# EAGLE schematic Ebot8_v_1.2 (EAGLE 7.7.0)
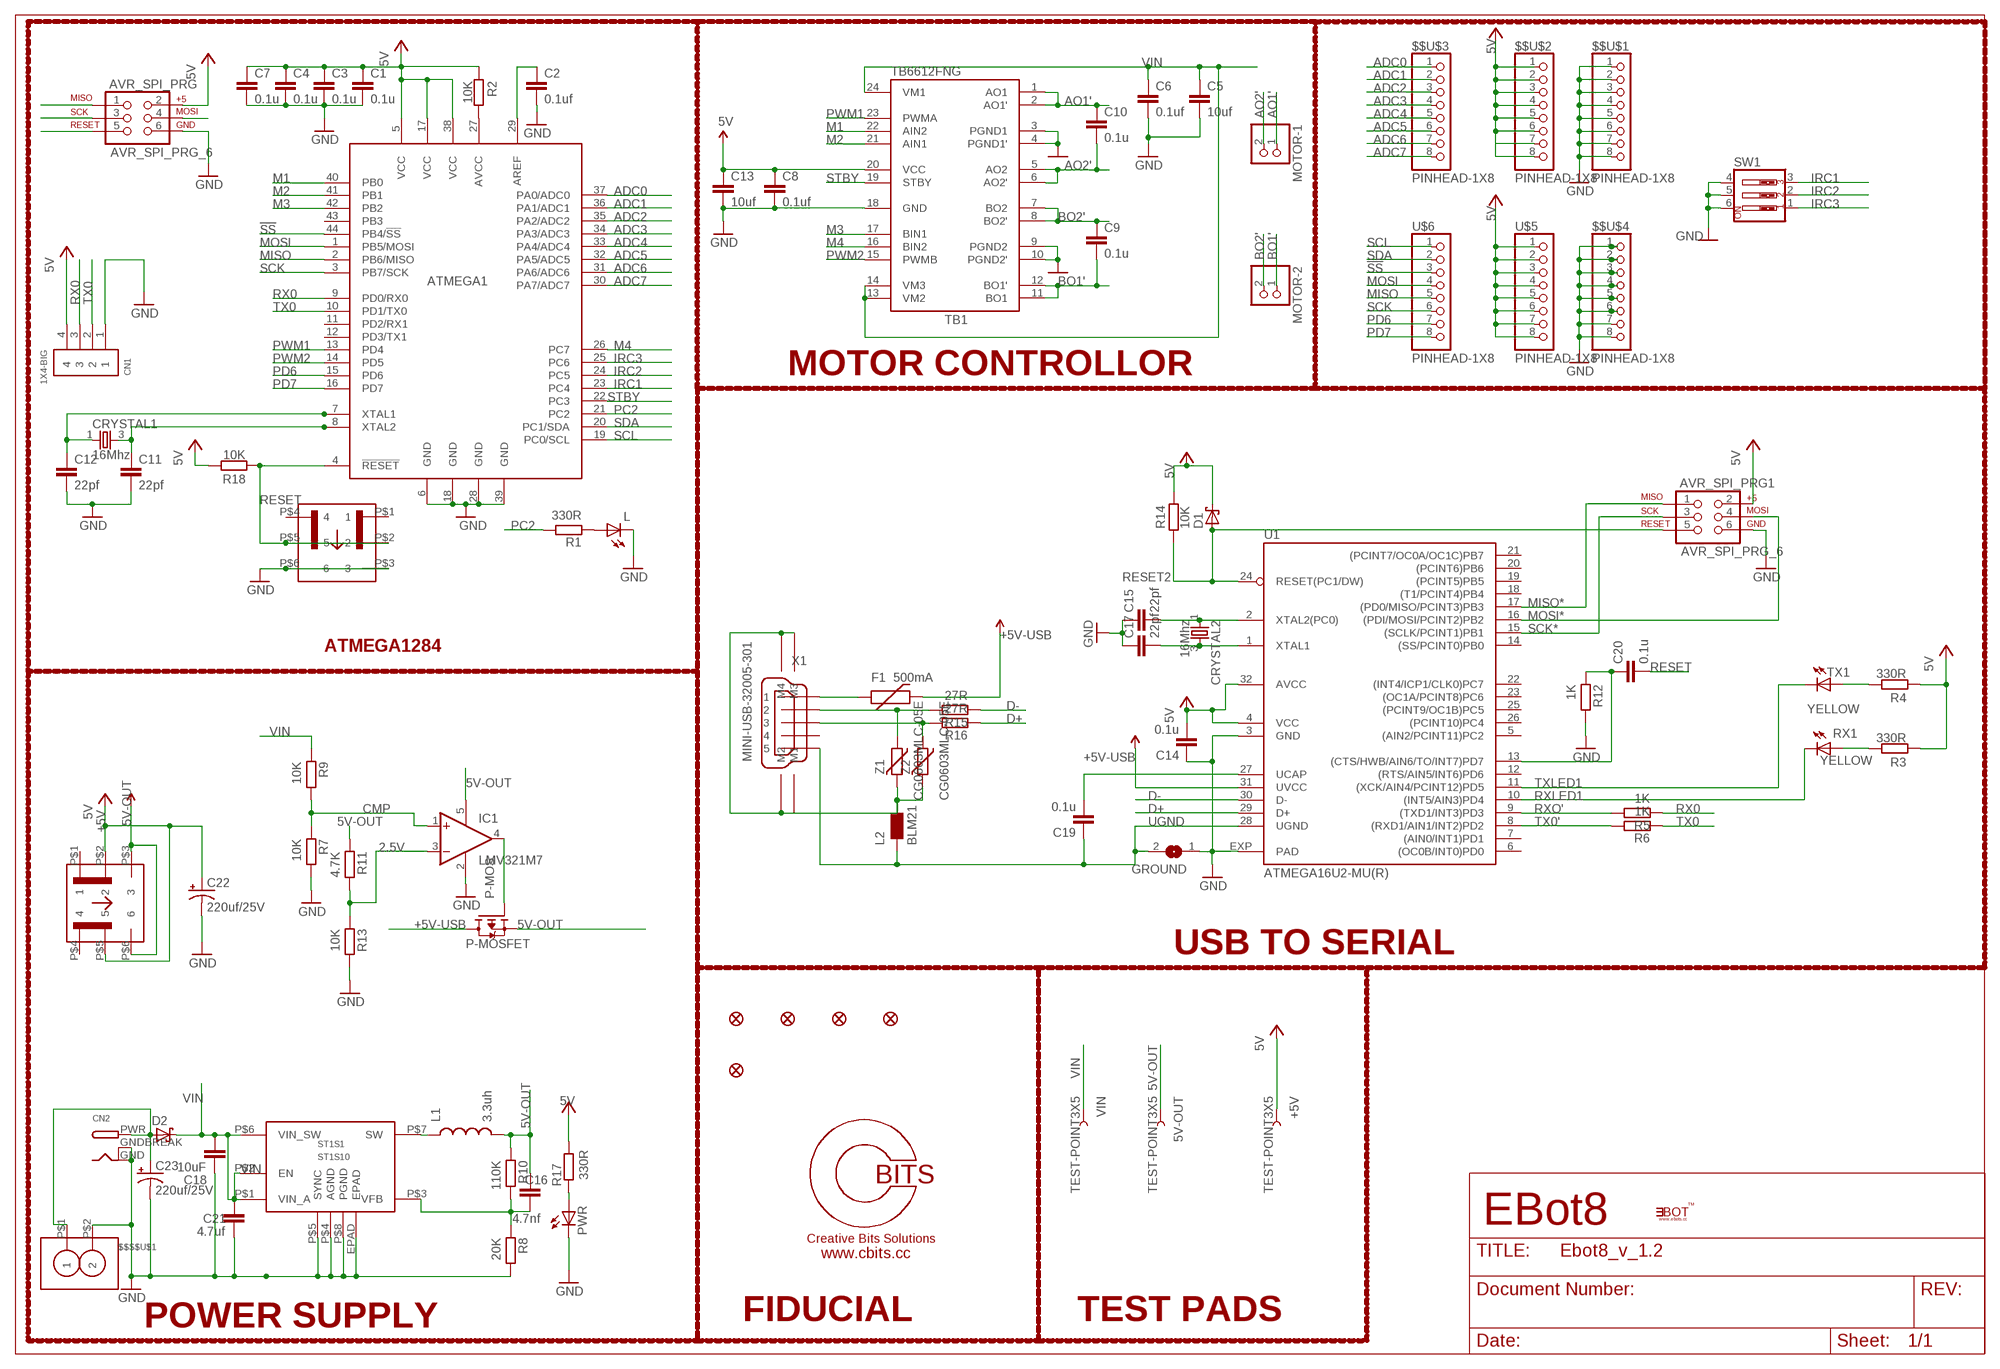
[diagram p0: schematic, sheet 1]

## Parts
5V-OUT  TEST-POINT3X5  [PAD.03X.05]
$$$$U$1  SCREW_CONNECTOR-2PIN-  [SCREW_CONNECTOR-2PIN-5.08MM]
$$U$1  PINHEAD-1X8  [PINHEAD-1X8]
$$U$2  PINHEAD-1X8  [PINHEAD-1X8]
$$U$3  PINHEAD-1X8  [PINHEAD-1X8]
$$U$4  PINHEAD-1X8  [PINHEAD-1X8]
+5V  TEST-POINT3X5  [PAD.03X.05]
ATMEGA1  ATMEGA164A/PA/324A/PA/644A/PA/1284/P  [44TQFP]
AVR_SPI_PRG  AVR_SPI_PRG_6  [2X3]
AVR_SPI_PRG1  AVR_SPI_PRG_6  [2X3]
C1  0.1u  CAPACITOR  [C0603]
C2  0.1uf  CAPACITOR  [C0603]
C3  0.1u  CAPACITOR  [C0603]
C4  0.1u  CAPACITOR  [C0603]
C5  10uf  CAPACITOR  [C0603]
C6  0.1uf  CAPACITOR  [C0603]
C7  0.1u  CAPACITOR  [C0603]
C8  0.1uf  CAPACITOR  [C0603]
C9  0.1u  CAPACITOR  [C0603]
C10  0.1u  CAPACITOR  [C0603]
C11  22pf  CAPACITOR  [C0603]
C12  22pf  CAPACITOR  [C0603]
C13  10uf  CAPACITOR  [C0603]
C14  0.1u  CAPACITOR  [C0603]
C15  22pf  CAPACITOR  [C0603]
C16  4.7nf  CAPACITOR  [C0603]
C17  22pf  CAPACITOR  [C0603]
C18  10uF  CAPACITOR  [C0603]
C19  0.1u  CAPACITOR  [C0603]
C20  0.1u  CAPACITOR  [C0603]
C21  4.7uf  CAPACITOR  [C0603]
C22  220uf/25V  CPOL-USE2.5-6  [E2,5-6]
C23  220uf/25V  CPOL-USE2.5-6  [E2,5-6]
CN1  1X4-BIG  [1X04-BIG]
CN2  DCBARRELPTH  [DCJACK_2MM_PTH]
CRYSTAL1  16Mhz  CRYSTAL4PIN  [CRYSTAL-4PIN]
CRYSTAL2  16Mhz  CRYSTAL4PIN  [CRYSTAL-4PIN]
D1  SCHOTTKY-DIODESMA2  [SCHOTTKY_SMA]
D2  SCHOTTKY-DIODESMA2  [SCHOTTKY_SMA]
F1  500mA  PTCSMD  [PTC-1206]
FID1  FIDUCIAL1.5X3  [FIDUCIAL-1.5X3]
FID2  FIDUCIAL1.5X3  [FIDUCIAL-1.5X3]
FID3  FIDUCIAL1.5X3  [FIDUCIAL-1.5X3]
FID4  FIDUCIAL1.5X3  [FIDUCIAL-1.5X3]
FID100  FIDUCIAL1.5X3  [FIDUCIAL-1.5X3]
GROUND  SJ  [SJ]
IC1  LMV321M7  [SC70-5L]
L  LEDCHIP-LED0603  [CHIP-LED0603]
L1  3.3uh  INDUCTORCR54  [CR54]
L2  BLM21  WE-CBF_0805  [0805]
LOGO1  CBITS_LOGO  [CBITS_LOGO]
MOTOR-1  PINHD-1X2  [1X02]
MOTOR-2  PINHD-1X2  [1X02]
P-MOS  P-MOSFET  [SOT23-R]
POWER  PUSHBUTTON_SWITCH-CW179-ND  PUSHBUTTON_SWITCH-ON-OFF  [PUSHBUTTON_SWITCH]
PWR  LEDCHIP-LED0603  [CHIP-LED0603]
R1  330R  RESISTOR  [R0603]
R2  10K  RESISTOR  [R0603]
R3  330R  RESISTOR  [R0603]
R4  330R  RESISTOR  [R0603]
R5  1K  RESISTOR  [R0603]
R6  1K  RESISTOR  [R0603]
R7  10K  RESISTOR  [R0603]
R8  20K  RESISTOR  [R0603]
R9  10K  RESISTOR  [R0603]
R10  110K  RESISTOR  [R0603]
R11  4.7K  RESISTOR  [R0603]
R12  1K  RESISTOR  [R0603]
R13  10K  RESISTOR  [R0603]
R14  10K  RESISTOR  [R0603]
R15  27R  RESISTOR  [R0603]
R16  27R  RESISTOR  [R0603]
R17  330R  RESISTOR  [R0603]
R18  10K  RESISTOR  [R0603]
RESET  PUSHBUTTON_SWITCH-ON-MOM  [PUSHBUTTON_SWITCH]
RX1  YELLOW  LEDCHIP-LED0603  [CHIP-LED0603]
ST1S1  ST1S10  [ST1S10]
SW1  SW_DIP-3  [EDG-03]
TB1  TB6612FNG  [SSOP24]
TX1  YELLOW  LEDCHIP-LED0603  [CHIP-LED0603]
U1  ATMEGA16U2-MU(R)  SMARTPRJ_ATMEGA16U2-  [SMARTPRJ_ATMEL_QFN32]
U$5  PINHEAD-1X8  [PINHEAD-1X8]
U$6  PINHEAD-1X8  [PINHEAD-1X8]
U$14  EBOT_LOGO  [EBOT_LOGO]
VIN  TEST-POINT3X5  [PAD.03X.05]
X1  MINI-USB-32005-301  [32005-301]
Z1  CG0603MLC-05E  VARISTORCN0603  [CT/CN0603]
Z2  CG0603MLC-05E  VARISTORCN0603  [CT/CN0603]

## Nets
2.5V: IC1.3(-IN) R11.2 R13.1
5V-OUT: 5V-OUT.P$1 C16.1 IC1.5(V+) L1.P$2 P-MOS.2(S) POWER.P$3 POWER.P$6 R10.1 R11.1 ; supply symbol labelled 5V
!SS: ATMEGA1.44(PB4/!SS) U$6.3
+5V: $$U$2.1 $$U$2.2 $$U$2.3 $$U$2.4 $$U$2.5 $$U$2.6 $$U$2.7 $$U$2.8 +5V.P$1 ATMEGA1.5(VCC) ATMEGA1.17(VCC) ATMEGA1.38(VCC) AVR_SPI_PRG1.2 AVR_SPI_PRG.2 C1.1 C3.1 C4.1 C7.1 C8.1 C13.1 C14.2 C22.+ CN1.4 D1.C POWER.P$2 POWER.P$5 R2.1 R3.1 R4.1 R14.2 R17.2 R18.2 TB1.20(VCC) U1.4(VCC) U1.32(AVCC) U$5.1 U$5.2 U$5.3 U$5.4 U$5.5 U$5.6 U$5.7 U$5.8 ; supply symbol labelled 5V
+5V-USB: F1.2 P-MOS.3(D) U1.31(UVCC) ; supply symbol labelled 5V
ADC0: $$U$3.1 ATMEGA1.37(PA0/ADC0)
ADC1: $$U$3.2 ATMEGA1.36(PA1/ADC1)
ADC2: $$U$3.3 ATMEGA1.35(PA2/ADC2)
ADC3: $$U$3.4 ATMEGA1.34(PA3/ADC3)
ADC4: $$U$3.5 ATMEGA1.33(PA4/ADC4)
ADC5: $$U$3.6 ATMEGA1.32(PA5/ADC5)
ADC6: $$U$3.7 ATMEGA1.31(PA6/ADC6)
ADC7: $$U$3.8 ATMEGA1.30(PA7/ADC7)
AO1': C10.1 MOTOR-1.1 TB1.1(AO1) TB1.2(AO1')
AO2': C10.2 MOTOR-1.2 TB1.5(AO2) TB1.6(AO2')
AREF: ATMEGA1.29(AREF) C2.1
BO1': C9.2 MOTOR-2.1 TB1.11(BO1) TB1.12(BO1')
BO2': C9.1 MOTOR-2.2 TB1.7(BO2) TB1.8(BO2')
CMP: IC1.1(+IN) R7.1 R9.2
D+: R16.1 U1.29(D+)
D-: R15.1 U1.30(D-)
GATE_CMD: IC1.4(OUT) P-MOS.1(G)
GND: $$$$U$1.P$2 $$U$1.1 $$U$1.2 $$U$1.3 $$U$1.4 $$U$1.5 $$U$1.6 $$U$1.7 $$U$1.8 $$U$4.1 $$U$4.2 $$U$4.3 $$U$4.4 $$U$4.5 $$U$4.6 $$U$4.7 $$U$4.8 ATMEGA1.6(GND) ATMEGA1.18(GND) ATMEGA1.28(GND) ATMEGA1.39(GND) AVR_SPI_PRG1.6 AVR_SPI_PRG.6 C1.2 C2.2 C3.2 C4.2 C5.2 C6.2 C7.2 C8.2 C11.2 C12.2 C13.2 C14.1 C15.1 C17.1 C18.2 C21.2 C22.- C23.- CN1.1 CN2.GND CN2.GNDBREAK GROUND.1 IC1.2(V-) L.C PWR.C R7.2 R8.2 R12.2 R13.2 RESET.P$3 RESET.P$6 ST1S1.EPAD ST1S1.P$4(AGND) ST1S1.P$5(SYNC) ST1S1.P$8(PGND) SW1.4 SW1.5 SW1.6 TB1.3(PGND1) TB1.4(PGND1') TB1.9(PGND2) TB1.10(PGND2') TB1.18(GND) U1.3(GND) U1.EXP(PAD)
IRC1: ATMEGA1.23(PC4) SW1.3
IRC2: ATMEGA1.24(PC5) SW1.2
IRC3: ATMEGA1.25(PC6) SW1.1
M1: ATMEGA1.40(PB0) TB1.22(AIN2)
M2: ATMEGA1.41(PB1) TB1.21(AIN1)
M3: ATMEGA1.42(PB2) TB1.17(BIN1)
M4: ATMEGA1.26(PC7) TB1.16(BIN2)
MISO: ATMEGA1.2(PB6/MISO) AVR_SPI_PRG.1 U$6.5
MISO*: AVR_SPI_PRG1.1 U1.17((PD0/MISO/PCINT3)PB3)
MOSI: ATMEGA1.1(PB5/MOSI) AVR_SPI_PRG.4 U$6.4
MOSI*: AVR_SPI_PRG1.4 U1.16((PDI/MOSI/PCINT2)PB2)
N$1: PWR.A R17.1
N$2: $$$$U$1.P$1 C23.+ CN2.PWR D2.A
N$3: R3.2 RX1.A
N$4: R4.2 TX1.A
N$5: C15.2 CRYSTAL2.1 U1.2(XTAL2(PC0))
N$6: ATMEGA1.27(AVCC) R2.2
N$7: C17.2 CRYSTAL2.3 U1.1(XTAL1)
N$8: C19.2 U1.27(UCAP)
N$9: C20.1 R12.1 U1.13((CTS/HWB/AIN6/TO/INT7)PD7)
N$10: L2.2 X1.M1 X1.M2 X1.M3 X1.M4 Z1.2 Z2.2
N$17: L.A R1.1
N$20: F1.1 X1.1
N$21: R15.2 X1.2 Z1.1
N$23: R16.2 X1.3 Z2.1
N$37: L1.P$1 ST1S1.P$7(SW)
N$38: C16.2 R8.1 R10.2 ST1S1.P$3(VFB)
N$40: ATMEGA1.8(XTAL2) C11.1 CRYSTAL1.3
N$41: ATMEGA1.7(XTAL1) C12.1 CRYSTAL1.1
PC2: ATMEGA1.21(PC2) R1.2
PD6: ATMEGA1.15(PD6) U$6.7
PD7: ATMEGA1.16(PD7) U$6.8
PWM1: ATMEGA1.13(PD4) TB1.23(PWMA)
PWM2: ATMEGA1.14(PD5) TB1.15(PWMB)
RESET: ATMEGA1.4(!RESET) AVR_SPI_PRG.5 C20.2 R18.1 RESET.P$2 RESET.P$5
RESET2: AVR_SPI_PRG1.5 D1.A R14.1 U1.24(RESET(PC1/DW))
RX0: ATMEGA1.9(PD0/RX0) CN1.3 R5.1
RXLED1: RX1.C U1.10((INT5/AIN3)PD4)
RXO': R5.2 U1.9((TXD1/INT3)PD3)
SCK: ATMEGA1.3(PB7/SCK) AVR_SPI_PRG.3 U$6.6
SCK*: AVR_SPI_PRG1.3 U1.15((SCLK/PCINT1)PB1)
SCL: ATMEGA1.19(PC0/SCL) U$6.1
SDA: ATMEGA1.20(PC1/SDA) U$6.2
STBY: ATMEGA1.22(PC3) TB1.19(STBY)
TX0: ATMEGA1.10(PD1/TX0) CN1.2 R6.1
TX0': R6.2 U1.8((RXD1/AIN1/INT2)PD2)
TXLED1: TX1.C U1.11((XCK/AIN4/PCINT12)PD5)
UGND: C19.1 GROUND.2 L2.1 U1.28(UGND) X1.5
VIN: C5.1 C6.1 C18.1 C21.1 D2.C R9.1 ST1S1.P$1(VIN_A) ST1S1.P$2(EN) ST1S1.P$6(VIN_SW) TB1.13(VM2) TB1.14(VM3) TB1.24(VM1) VIN.P$1
Unconnected: ATMEGA1.11(PD2/RX1) ATMEGA1.12(PD3/TX1) ATMEGA1.43(PB3) POWER.P$1 POWER.P$4 RESET.P$1 RESET.P$4 U1.5((AIN2/PCINT11)PC2) U1.6((OC0B/INT0)PD0) U1.7((AIN0/INT1)PD1) U1.12((RTS/AIN5/INT6)PD6) U1.14((SS/PCINT0)PB0) U1.18((T1/PCINT4)PB4) U1.19((PCINT5)PB5) U1.20((PCINT6)PB6) U1.21((PCINT7/OC0A/OC1C)PB7) U1.22((INT4/ICP1/CLK0)PC7) U1.23((OC1A/PCINT8)PC6) U1.25((PCINT9/OC1B)PC5) U1.26((PCINT10)PC4) X1.4

## Notes on the sheet
- MOTOR CONTROLLOR
- ATMEGA1284
- USB TO SERIAL
- EBot8
- POWER SUPPLY | FIDUCIAL | TEST PADS

## Power pins joined to a net without a drawn wire
GND: ST1S1.P$9(GND) ST1S1.P$10(GND) ST1S1.P$11(GND) ST1S1.P$12(GND) ST1S1.P$13(GND) ST1S1.P$14(GND) ST1S1.P$15(GND) ST1S1.P$16(GND) ST1S1.P$17(GND)

## Library data of the parts
5V-OUT +5V VIN = SparkFun-Passives:TEST-POINT: Bare copper test points for troubleshooting or ICT
$$$$U$1 = BaseApp:SCREW_CONNECTOR-2PIN
$$U$1-$$U$4 U$5 U$6 = BaseApp:PINHEAD-1X8
ATMEGA1 = BaseApp:ATMEGA164A/PA/324A/PA/644A/PA/1284/P
AVR_SPI_PRG AVR_SPI_PRG1 = BaseApp:AVR_SPI_PRG_6
C1-C21 = BaseApp:CAPACITOR
C22 C23 = adafruit:CPOL-US: POLARIZED CAPACITOR, American symbol
CN1 = adafruit:1X4: 4-pin connector
CN2 = adafruit:DCBARREL: 2.0mm DC Barrel Jack DCJACK_2MM_PTH - Through Hole Jack (4UConnector: 05537)
CRYSTAL1 CRYSTAL2 = BaseApp:CRYSTAL: CRYSTAL SMD-10.5X4.8-2PIN :- http://www.digikey.com/product-detail/en/CX49GFNB12000H0PESZZ/478-4349-1-ND/1532102 SMD-5X3- 4PIN :- 535-11281-1-ND
D1 D2 = BaseApp:SCHOTTKY-DIODE
F1 = SparkFun:PTC: Resettable Fuse PTC Resettable Fuse. Spark Fun Electronics SKU : COM-08357
FID1-FID4 FID100 = SparkFun-Aesthetics:FIDUCIAL: Fiducial Alignment Points Various fiducial points for machine vision alignment.
GROUND = jumper:SJ: SMD solder JUMPER
IC1 = linear:LMV321?*: General Purpose, Low Voltage, Rail-to-Rail Output Operational Amplifiers Source: http://www.national.com/mpf/LM/LMV321.html http://www.national.com/dt/lmv_qual.pdf
L PWR RX1 TX1 = adafruit:LED: LED OSRAM: - CHIPLED LG R971, LG N971, LY N971, LG Q971, LY Q971, LO R971, LY R971 LH N974, LH R974 LS Q976, LO Q976, LY Q976 LO Q996 - Hyper CHIPLED LW Q18S LB Q993, LB Q99A, LB R99A - SideLED LS A670, LO A670, LY A670, LG A670, LP A670 LB A673, LV A673, LT A673, LW A673 LH A674 LY A675 LS A676, LA A676, LO A676, LY A676, LW A676 LS A679, LY A679, LG A679 - Hyper Micro SIDELED® LS Y876, LA Y876, LO Y876, LY Y876 LT Y87S - SmartLED LW L88C, LW L88S LB L89C, LB L89S, LG L890 LS L89K, LO L89K, LY L89K LS L896, LA L896, LO L896, LY L896 - TOPLED LS T670, LO T670, LY T670, LG T670, LP T670 LSG T670, LSP T670, LSY T670, LOP T670, LYG T670 LG T671, LOG T671, LSG T671 LB T673, LV T673, LT T673, LW T673 LH T674 LS T676, LA T676, LO T676, LY T676, LB T676, LH T676, LSB T676, LW T676 LB T67C, LV T67C, LT T67C, LS T67K, LO T67K, LY T67K, LW E67C LS E67B, LA E67B, LO E67B, LY E67B, LB E67C, LV E67C, LT E67C LW T67C LS T679, LY T679, LG T679 LS T770, LO T770, LY T770, LG T770, LP T770 LB T773, LV T773, LT T773, LW T773 LH T774 LS E675, LA E675, LY E675, LS T675 LS T776, LA T776, LO T776, LY T776, LB T776 LHGB T686 LT T68C, LB T68C - Hyper Mini TOPLED® LB M676 - Mini TOPLED Santana® LG M470 LS M47K, LO M47K, LY M47K Source: http://www.osram.convergy.de/
L1 = SparkFun-Passives:INDUCTOR: Inductors Basic Inductor/Choke - 0603 and 1206. Footprints are not proven and vary greatly between part numbers.
L2 = wuerth-elektronik:WE-CBF: SMD EMI Suppression Ferrite Beads - excellent anti-EMI properties - low DCR - impedances till 3000 ohms - rated current up to 6 A
LOGO1 = cbitslogo:CBITS_LOGO
MOTOR-1 MOTOR-2 = pinhead:PINHD-1X2: PIN HEADER
P-MOS = BaseApp:P-MOSFET
POWER RESET = BaseApp:PUSHBUTTON_SWITCH: On-Off type's Digikey No. : CW179-ND. On-Mom type's Digikey No. : CW180-ND.
R1-R18 = BaseApp:RESISTOR: Resistance Package :- 0603 Mount :-Surface mount
ST1S1 = BaseApp:ST1S10
SW1 = special:SW_DIP-3: DIP SWITCH
TB1 = adafruit:TB6612FNG: TB6612FNG MOS dual H-bridge motor driver, 1.2A current 3.2A peak 3 or 5v logic and 3-15v motor
U1 = arduino_Uno_Rev3-02-TH:SMARTPRJ_ATMEGA16U2-
U$14 = creativeBits:EBOT_LOGO
X1 = con-cypressindustries:MINI-USB-: MINI USB-B Conector Source: www.cypressindustries.com; OC_FARNELL: unknown; OC_NEWARK: unknown
Z1 Z2 = varistor:VARISTOR: VARISTOR

## Net classes
0 default: width 0.152 mm, drill 0.305 mm, clearance 0.152 mm